# EAGLE design Joe_final hack3 (EAGLE 7.5.0)
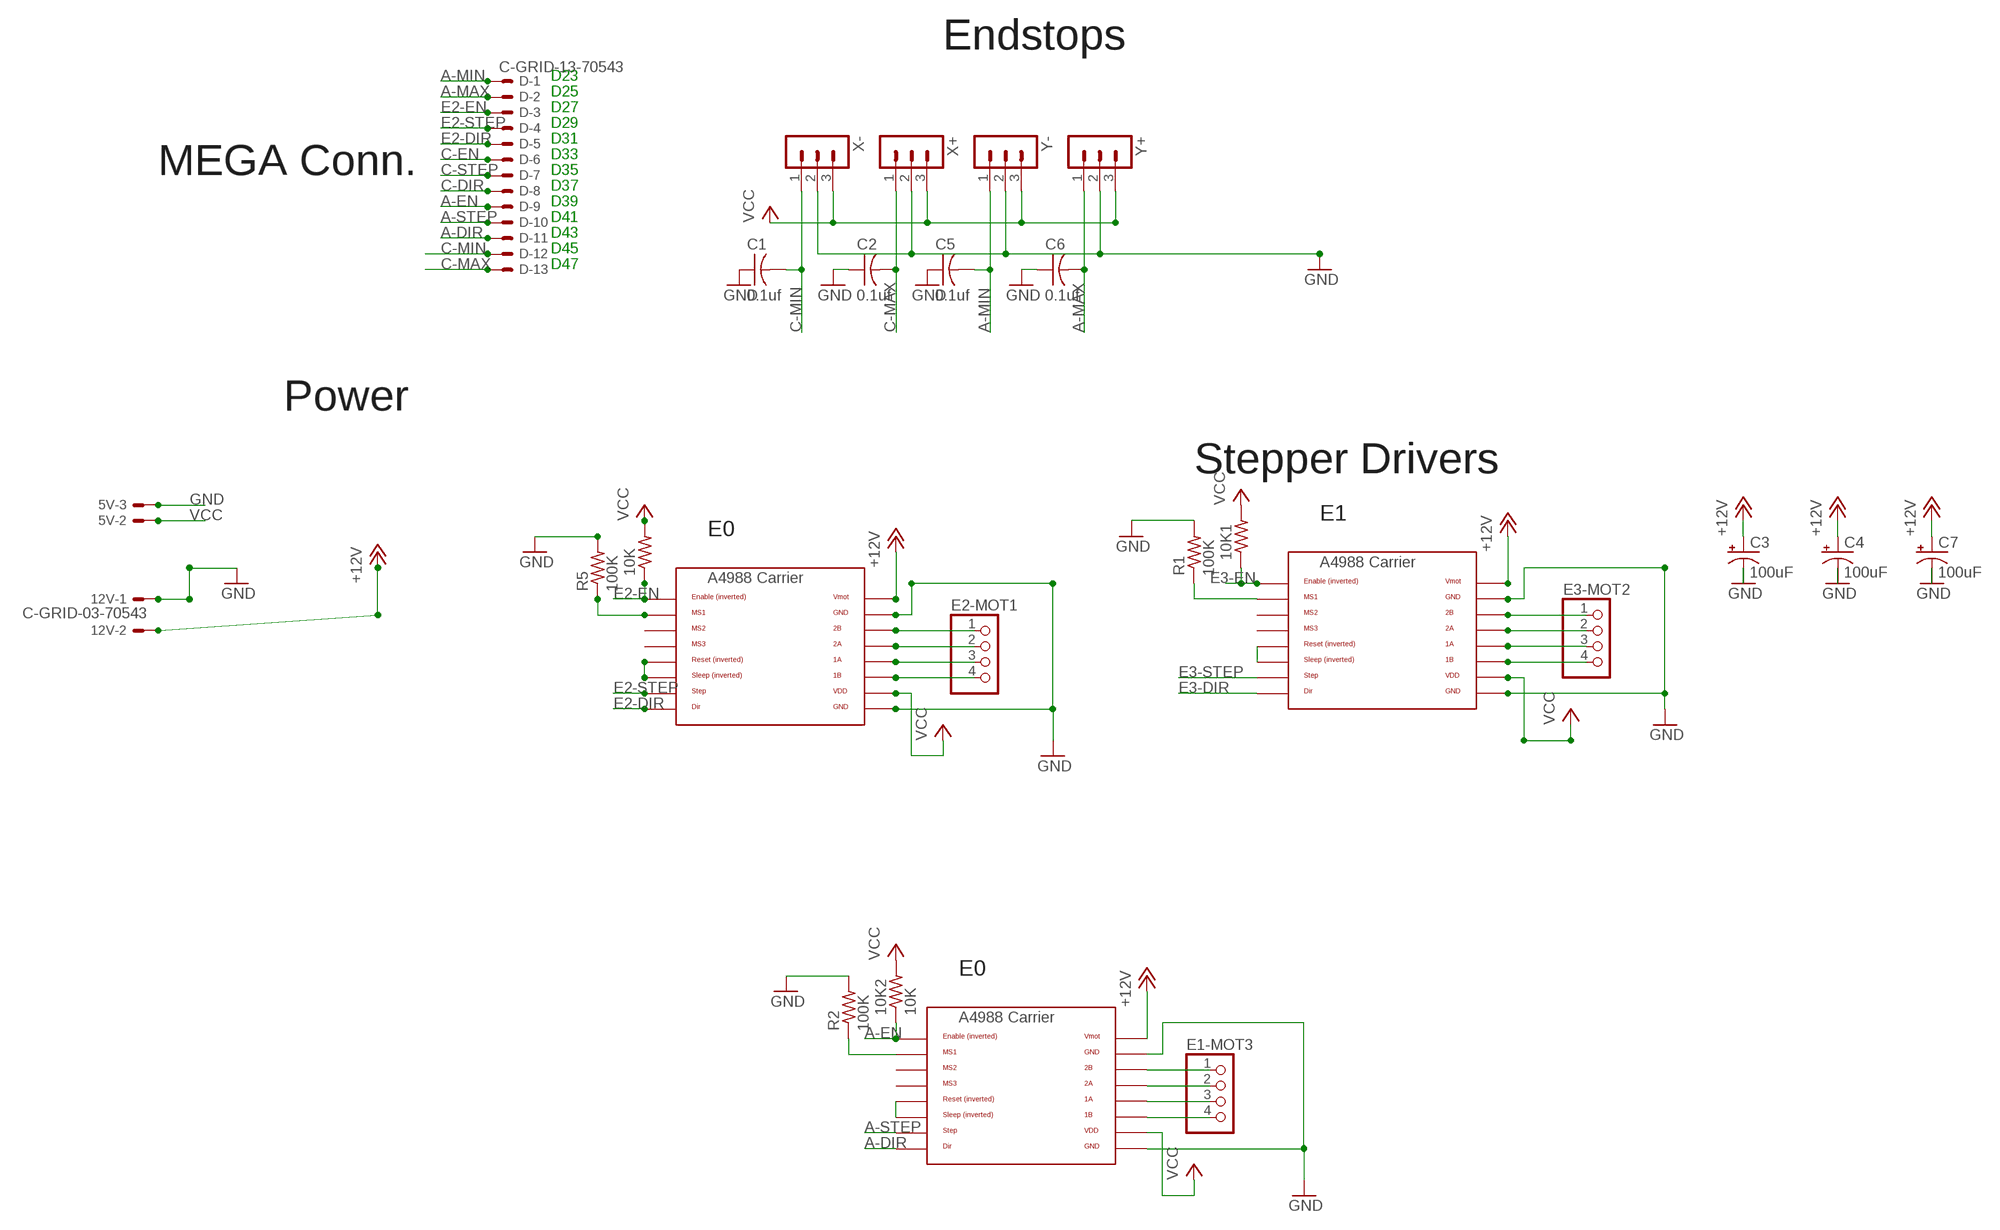
[diagram p0: schematic, sheet 1]

## Parts
5V  C-GRID-03-70543  [70543-03]
10K  RES-US1206FAB  [R1206FAB]
10K1  RES-US1206FAB  [R1206FAB]
10K2  10K  RES-US1206FAB  [R1206FAB]
12V  C-GRID-03-70543  [70543-03]
C1  0.1uf  CAP-US1206FAB  [C1206FAB]
C2  0.1uf  CAP-US1206FAB  [C1206FAB]
C3  100uF  CPOL-US153CLV-0605  [153CLV-0605]
C4  100uF  CPOL-US153CLV-0605  [153CLV-0605]
C5  0.1uf  CAP-US1206FAB  [C1206FAB]
C6  0.1uf  CAP-US1206FAB  [C1206FAB]
C7  100uF  CPOL-US153CLV-0605  [153CLV-0605]
D  C-GRID-13-70543  [70543-13]
E1-MOT3  PINHD-1X4  [1X04]
E2-MOT1  PINHD-1X4  [1X04]
E3-MOT2  PINHD-1X4  [1X04]
R1  100K  RES-US1206FAB  [R1206FAB]
R2  100K  RES-US1206FAB  [R1206FAB]
R5  100K  RES-US1206FAB  [R1206FAB]
U$1  A4988BREAKOUT  [A4988BREAKOUT]
U$4  A4988BREAKOUT  [A4988BREAKOUT]
U$5  A4988BREAKOUT  [A4988BREAKOUT]
X+  3PIN-HEADER  [3PIN-HEADER]
X-  3PIN-HEADER  [3PIN-HEADER]
Y+  3PIN-HEADER  [3PIN-HEADER]
Y-  3PIN-HEADER  [3PIN-HEADER]

## Nets
+12V: 12V.2 C3.+ C4.+ C7.+ U$1.VMOT U$4.VMOT U$5.VMOT
A-DIR: D.11 U$1.DIR
A-EN: 10K2.1 D.9 U$1.EN
A-MAX: C6.2 D.2 Y+.1
A-MIN: C5.2 D.1 Y-.1
A-STEP: D.10 U$1.STEP
C-DIR: D.8
C-EN: D.6
C-MAX: C2.2 D.13 X+.1
C-MIN: C1.2 D.12 X-.1
C-STEP: D.7
E2-DIR: D.5 U$4.DIR
E2-EN: 10K.1 D.3 U$4.EN
E2-STEP: D.4 U$4.STEP
E3-DIR: U$5.DIR
E3-EN: 10K1.1 U$5.EN
E3-STEP: U$5.STEP
GND: 5V.3 12V.1 C1.1 C2.1 C3.- C4.- C5.1 C6.1 C7.- R1.2 R2.2 R5.2 U$1.GND U$1.GND@0(GND) U$4.GND U$4.GND@0(GND) U$5.GND U$5.GND@0(GND) X+.2 X-.2 Y+.2 Y-.2
N$1: E1-MOT3.1 U$1.2B
N$2: U$1.RST U$1.SLP(SLEEP)
N$3: E1-MOT3.2 U$1.2A
N$4: E2-MOT1.1 U$4.2B
N$5: R5.1 U$4.MS1
N$6: E1-MOT3.3 U$1.1A
N$7: R2.1 U$1.MS1
N$8: U$4.RST U$4.SLP(SLEEP)
N$9: E1-MOT3.4 U$1.1B
N$10: E2-MOT1.2 U$4.2A
N$11: E2-MOT1.3 U$4.1A
N$12: E2-MOT1.4 U$4.1B
N$13: E3-MOT2.1 U$5.2B
N$14: E3-MOT2.2 U$5.2A
N$15: E3-MOT2.3 U$5.1A
N$16: E3-MOT2.4 U$5.1B
N$24: U$5.RST U$5.SLP(SLEEP)
N$25: R1.1 U$5.MS1
VCC: 5V.2 10K1.2 10K2.2 10K.2 U$1.VDD U$4.VDD U$5.VDD X+.3 X-.3 Y+.3 Y-.3
Unconnected: 5V.1 12V.3 U$1.MS2 U$1.MS3 U$4.MS2 U$4.MS3 U$5.MS2 U$5.MS3

## Notes on the sheet
- Endstops
- D23
- D25
- D27
- D29
- D31
- D33
- MEGA Conn. | D35
- D37
- D39
- D41
- D43
- D45
- D47
- Power
- Stepper Drivers
- E1
- E0
- E0

## Library data of the parts
5V 12V = con-molex:C-GRID-03: CONNECTOR wire to board 2.54 mm (0.100") pitch header; OC_FARNELL: unknown; OC_NEWARK: unknown
10K 10K1 10K2 R1 R2 R5 = fab:RES-US: Resistor (US Symbol) Variants with postfix FAB are widened to allow the routing of internal traces
C1 C2 C5 C6 = fab:CAP-US
C3 C4 C7 = adafruit:CPOL-US: POLARIZED CAPACITOR, American symbol
D = con-molex:C-GRID-13: CONNECTOR wire to board 2.54 mm (0.100") pitch header; OC_FARNELL: unknown; OC_NEWARK: unknown
E1-MOT3 E2-MOT1 E3-MOT2 = RepRapjr:PINHD-1X4: PIN HEADER
U$1 U$4 U$5 = RepRapjr:A4988BREAKOUT
X+ X- Y+ Y- = ultimachine:3PIN-HEADER: PIN HEADER

## Board
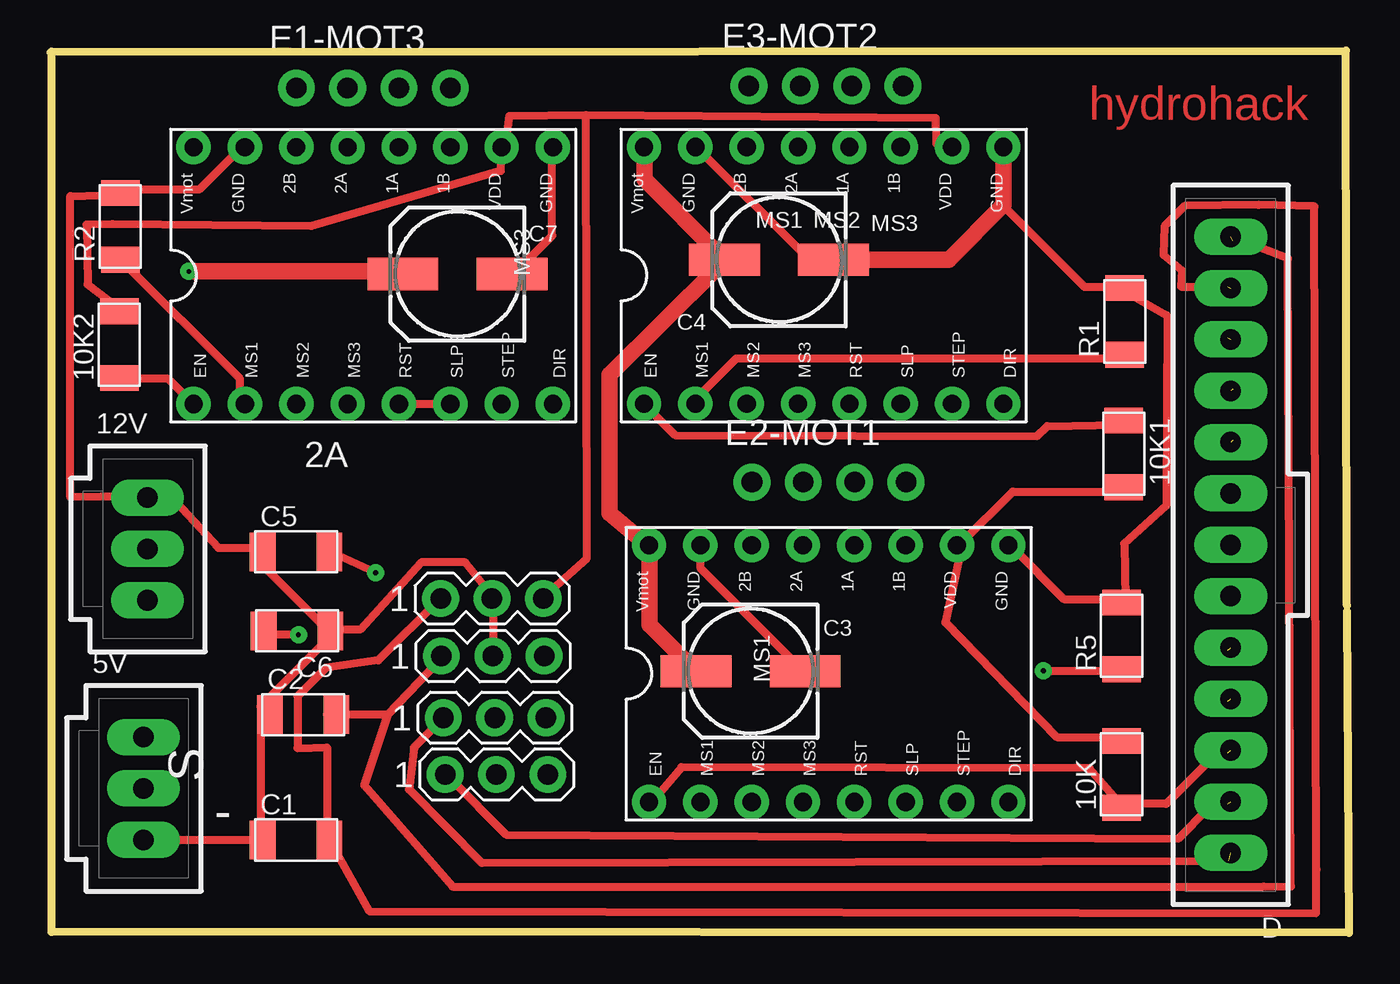
[diagram p1: board, top side]
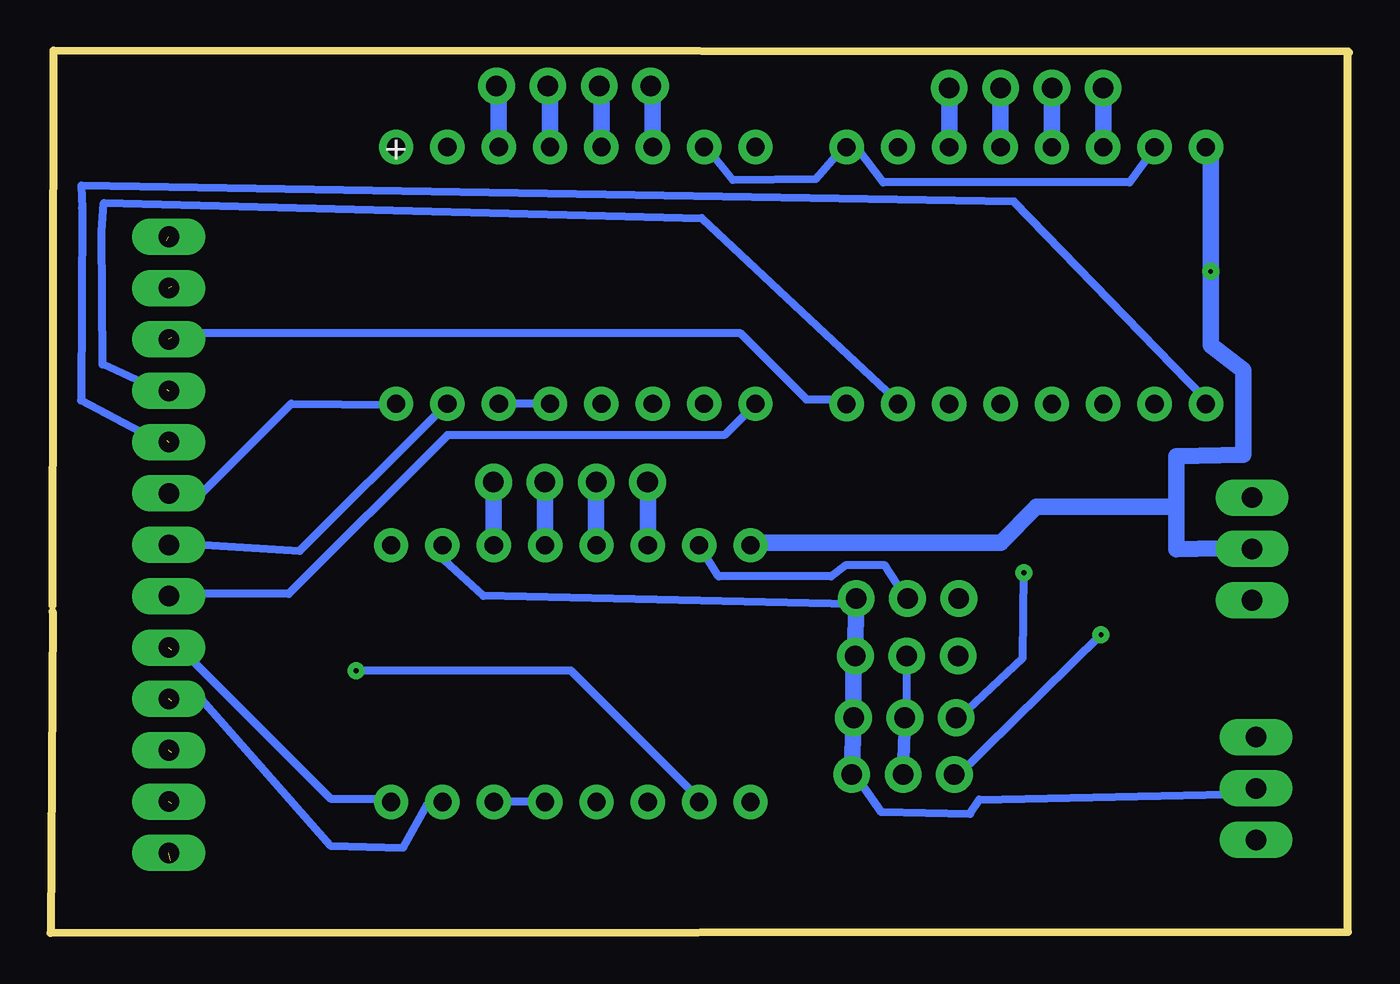
[diagram p2: board, bottom side, seen from below]

Size 64.25 x 43.65 mm. Coordinates in mm from the lower left corner, seen from the top.
Outline: 64.15,16.2 64.1,43.65 0.05,43.6 0.05,43.55
Outline: 64.15,15.9 64.25,0 0.05,0.05 0.05,43.55
Outline: 0.05,43.55 0,43.55
Copper layers (1*16): Top 0.035mm / dielectric 1.6mm / Bottom 0.035mm
Design rules "PCB-CART *": minimum track width 0.1mm, minimum drill 0.1mm, track to track 16mil, track to pad 16mil, pad to pad 16mil, via to via 16mil, smd to smd 16mil, copper to edge 0.1mm, drill to drill 0.1mm, minimum pad ring 0.4mm, minimum via ring 0.3mm, stop-mask expansion 3mil, vias tented up to drill 0.5mm, thermal gap 12mil

### Footprints (pad centres in the part's own frame; a part is rotated, then mirrored left to right if it is on the bottom)
70543-03 = drill 1.016 long: 1 -2.54,0; 2 0,0; 3 2.54,0
R1206FAB = smd 1.27 x 1.905: 1 -1.651,0; 2 1.651,0
C1206FAB = smd 1.27 x 1.905: 1 -1.651,0; 2 1.651,0
153CLV-0605 = smd 3.5 x 1.6: + 2.7,0; - -2.7,0
70543-13 = drill 1.016 long: 1 -15.24,0; 2 -12.7,0; 3 -10.16,0; 4 -7.62,0; 5 -5.08,0; 6 -2.54,0; 7 0,0; 8 2.54,0; 9 5.08,0; 10 7.62,0; 11 10.16,0; 12 12.7,0; 13 15.24,0
1X04 = drill 1.016: 1 -2.54,0; 2 0,0; 3 2.54,0; 4 5.08,0
A4988BREAKOUT = drill 0.9: 1A 8.89,1.27; 1B 11.43,1.27; 2A 6.35,1.27; 2B 3.81,1.27; DIR 16.51,-11.43; EN -1.27,-11.43; GND 16.51,1.27; GND@0 1.27,1.27; MS1 1.27,-11.43; MS2 3.81,-11.43; MS3 6.35,-11.43; RST 8.89,-11.43; SLP 11.43,-11.43; STEP 13.97,-11.43; VDD 13.97,1.27; VMOT -1.27,1.27
3PIN-HEADER = drill 1.016: 1 -2.54,0; 2 0,0; 3 2.54,0

### Placement (x,y rotation side)
5V  4.6,7.15 270 top
10K  53,7.85 90 top
10K1  53.1,23.7 270 top
10K2  3.4,29.1 90 top
12V  4.8,19 270 top
C1  12.15,4.6 0 top
C2  12.5,10.8 0 top
C3  34.64,12.95 180 top
C4  36.05,33.3 180 top
C5  12.15,18.85 0 top
C6  12.2,14.95 180 top
C7  20.14,32.59 180 top
D  58.4,19.2 90 top
E1-MOT3  14.7,41.8 0 top
E2-MOT1  37.25,22.3 0 top
E3-MOT2  37.1,41.9 0 top
R1  53.15,30.25 90 top
R2  3.45,34.95 90 top
R5  53,14.7 90 top
U$1  8.35,37.6 0 top
U$4  30.88,17.91 0 top
U$5  30.64,37.61 0 top
X+  21.88,13.7 0 top
X-  21.84,16.55 0 top
Y+  22.06,7.85 0 top
Y-  21.97,10.65 0 top

### Tracks (layer width: path | path; a pad name or v marks a point on that pad's centre or on a via)
+12V  (via drill 0.24 pad 0.41)
  Top 0.1: 29.38,38.8 U$5.VMOT | 33.18,33.48 C4.+ 33.18,33.23 32.98,32.87 | 29.63,19.05 U$4.VMOT 29.38,19.3 | 31.91,12.97 C3.+ | 17.23,32.72 C7.+
  Top 0.2: 33.25,33.2 C4.+
  Top 0.813: 29.38,38.8 29.38,37.28 33.18,33.48 | 29.63,19.05 29.63,15.25 31.91,12.97 | 32.98,32.87 27.66,27.61 27.66,20.77 29.38,19.3 | v6.85,32.72 17.23,32.72
  Bottom 0.1: 5.33,19.05 4.82,19.05 12V.2 | 6.85,38.8 U$1.VMOT | 29.38,19.3 U$4.VMOT
  Bottom 0.813: 6.85,38.8 v6.85,32.72 6.85,29.06 5.23,27.85 5.23,23.66 8.55,23.59 8.55,21.08 | 8.55,21.08 8.55,18.97 5.33,19.05 | 29.38,19.3 17.23,19.3 15.46,21.08 8.55,21.08
A-DIR  (1 unrouted)
  Bottom 0.406: 58.25,29.43 57.99,29.69 30.14,29.69 26.85,26.39 25.08,26.39 U$1.DIR
A-EN  (1 unrouted)
  Top 0.1: 3.56,27.41 10K2.1
  Top 0.406: 3.56,27.41 5.83,27.41 6.85,26.39 U$1.EN
  Bottom 0.406: 58.5,24.37 59.01,24.37 62.73,26.35 62.69,35.86 62.72,36.97 16.58,36.17 7.1,26.39 U$1.EN
A-MAX  (via drill 0.24 pad 0.41)  (1 unrouted)
  Top 0.1: 19.76,7.66 Y+.1 | 10.64,14.75 C6.2
  Top 0.406: 58.25,6.39 57.32,6.19 55.8,4.67 22.55,4.87 19.76,7.66 | v12.27,14.75 10.64,14.75
  Bottom 0.1: 19.51,7.66 Y+.1
  Bottom 0.406: 19.51,7.66 v12.27,14.75
A-MIN  (via drill 0.24 pad 0.41)  (1 unrouted)
  Top 0.1: 13.94,18.8 C5.2
  Top 0.406: 58.3,3.56 21.33,3.46 17.74,7.1 17.99,9.18 19.25,10.44 Y-.1 | v16.09,17.82 13.94,18.8
  Bottom 0.1: 19.25,10.7 Y-.1
  Bottom 0.406: v16.09,17.82 16.14,13.61 19.25,10.7
A-STEP  (1 unrouted)
  Bottom 0.406: 58.5,26.9 59.01,26.9 61.68,28.12 61.73,34.7 61.62,36.12 32.02,35.37 22.5,26.44 22.55,26.39 U$1.STEP
C-MAX  (1 unrouted)
  Top 0.1: 13.69,10.8 C2.2
  Top 0.406: 16.68,10.8 13.69,10.8 | 16.68,10.8 19.25,13.48 X+.1 | 58.5,34.24 59.01,34.24 61.23,33.37 61.38,2.3 60.02,2.29 19.89,2.29 15.53,7.3 16.68,10.8
C-MIN  (1 unrouted)
  Top 0.1: 13.68,4.62 C1.2 13.94,4.37 | 19.25,16.52 X-.1
  Top 0.406: 13.68,4.62 13.68,9.18 12.22,9.14 12.22,11.72 13.63,13.13 16.22,13.48 19.25,16.52 | 58.25,31.96 55.93,31.98 55.98,32.78 55.07,33.54 55.12,34.95 56.13,35.97 59.77,36.02 62.53,35.95 62.63,3.15 62.62,0.99 15.77,1.09 13.94,4.37
E2-DIR  (1 unrouted)
  Bottom 0.406: 58.25,13.99 57.74,13.99 50.4,6.64 47.61,6.64 U$4.DIR
E2-EN  (1 unrouted)
  Top 0.1: 53.18,6.39 10K.1 52.93,6.39
  Top 0.406: 53.18,6.39 55.21,6.39 57.74,8.92 58.25,8.92 | 52.93,6.39 51.41,8.16 31.21,8.21 29.94,6.69 29.63,6.64 U$4.EN
E2-STEP  (1 unrouted)
  Bottom 0.406: 58.25,11.46 56.79,11.55 50.41,4.33 46.8,4.23 45.59,6.39 45.08,6.39 U$4.STEP
E3-DIR
  Bottom 0.1: 47.36,26.14 U$5.DIR
  Bottom 0.406: 47.36,26.14 52.34,26.19 56.9,21.63
E3-EN
  Top 0.1: 52.93,25.13 10K1.1 | 29.38,26.14 U$5.EN
  Top 0.406: 52.93,25.13 49.32,25.08 48.81,24.57 30.9,24.62 29.38,26.14
  Bottom 0.406: 58.25,16.77 52.46,16.77 44.61,24.62 30.9,24.62 29.38,26.14 U$5.EN
E3-STEP
  Bottom 0.406: 58.25,19.3 51.92,18.9 45.08,25.74 44.83,26.14 U$5.STEP
GND
  Top 0.1: 32.05,38.8 U$5.GND@0 | 21.9,13.85 X+.2 | 21.9,16.45 X-.2 21.79,16.77 | 2.5,21.6 2.54,21.6 2.54,21.58 | 4.8,21.6 12V.1 | 52.93,16.52 R5.2 53.18,16.52 | 52.93,31.96 R1.2 53.18,31.71 | 24.82,38.8 U$1.GND | 23.05,32.72 C7.- | 32.17,19.05 U$4.GND@0 | 37.23,12.97 C3.- | 3.56,36.77 R2.2 3.3,36.52 | 4.82,4.62 5V.3 | 10.64,11.46 C2.1 10.39,11.2 | 13.94,14.75 C6.1 | 10.64,18.04 10.64,18.8 C5.1 10.39,19.05 | 13.68,15 C6.1 | 10.39,4.62 C1.1 | 13.94,15 C6.1
  Top 0.2: 37.45,33.4 38.65,33.4 C4.- | 4.75,21.55 12V.1
  Top 0.406: 32.05,38.8 37.45,33.4 | 21.9,16.45 21.9,13.85 | 2.54,21.6 4.8,21.6 | 52.93,16.52 50.14,16.52 47.61,19.05 U$4.GND | 52.93,31.96 51.16,31.96 47.14,35.99 | 24.82,38.8 24.82,34.5 23.05,32.72 | 53.18,16.52 53.13,19.26 55.2,21.13 55.25,30.54 53.18,31.71 | 32.17,19.05 32.17,18.04 37.23,12.97 | 3.56,36.77 7.35,36.77 9.38,38.8 U$1.GND@0 | 3.3,36.52 0.98,36.45 0.98,21.55 2.54,21.58 | 4.82,4.62 10.39,4.62 10.39,11.2 | 13.94,14.75 10.64,11.46 | 13.68,15 10.64,18.04 | 10.39,19.05 8.31,19.05 5.93,21.63 5.42,21.63 12V.1 | 13.94,15 15.31,15 18.35,18.34 20.52,18.34 21.79,16.77
  Top 0.813: U$5.GND 47.15,36 47.14,35.99 44.45,33.3 C4.-
  Bottom 0.1: 31.7,38.75 31.66,38.8 | 25.08,38.8 U$1.GND 24.82,38.8 | 22.04,16.77 X-.2 | 9.63,38.8 U$1.GND@0
  Bottom 0.2: 21.9,10.85 Y-.2 | 21.9,13.65 X+.2
  Bottom 0.406: 21.9,13.65 21.9,10.85 | 31.7,38.75 30.49,37.23 26.39,37.29 25.08,38.8 | 31.66,38.8 U$5.GND@0 | 22.04,16.77 22.95,18.19 24.92,18.19 25.63,17.63 31.19,17.63 32.11,19.1 32.16,19.2 U$4.GND@0 | 24.82,38.8 24.32,38.8 23.05,37.13 10.85,37.13 9.63,38.8
  Bottom 0.61: Y-.2 Y+.2
N$1
  Bottom 0.813: U$1.2B E1-MOT3.1
N$2
  Top 0.406: U$1.RST 17.4,26.15 19.6,26.15 U$1.SLP
N$3
  Bottom 0.813: U$1.2A E1-MOT3.2
N$4
  Bottom 0.406: 34.69,22.29 E2-MOT1.1
  Bottom 0.813: U$4.2B 34.69,22.29
N$5  (via drill 0.24 pad 0.41)
  Top 0.1: 52.93,12.97 R5.1
  Top 0.406: v49.13,12.97 52.93,12.97
  Bottom 0.1: 32.17,6.64 U$4.MS1
  Bottom 0.406: v49.13,12.97 38.5,12.97 32.17,6.64
N$6
  Bottom 0.813: U$1.1A E1-MOT3.3
N$7
  Top 0.1: 3.56,33.23 R2.1
  Top 0.406: 3.56,33.23 9.38,27.41 9.38,26.39 U$1.MS1
N$8
  Bottom 0.406: U$4.RST U$4.SLP
N$9
  Bottom 0.813: U$1.1B E1-MOT3.4
N$10
  Bottom 0.406: 37.25,19.2 U$4.2A
  Bottom 0.813: E2-MOT1.2 37.25,19.2
N$11
  Bottom 0.406: 39.77,22.29 E2-MOT1.3
  Bottom 0.813: U$4.1A 39.77,22.29
N$12
  Bottom 0.406: 42.31,22.29 E2-MOT1.4
  Bottom 0.813: U$4.1B 42.31,22.29
N$13
  Bottom 0.406: 34.45,41.79 E3-MOT2.1
  Bottom 0.813: U$5.2B 34.45,41.79
N$14
  Bottom 0.406: 36.99,41.79 E3-MOT2.2
  Bottom 0.813: U$5.2A 36.99,41.79
N$15
  Bottom 0.406: 39.53,41.79 E3-MOT2.3
  Bottom 0.813: U$5.1A 39.53,41.79
N$16
  Bottom 0.406: 42.07,41.79 E3-MOT2.4
  Bottom 0.813: U$5.1B 42.07,41.79
N$24
  Bottom 0.406: U$5.RST U$5.SLP
N$25
  Top 0.1: 52.93,28.42 R1.1
  Top 0.406: 52.93,28.42 33.94,28.42 31.91,26.39 U$5.MS1
VCC
  Top 0.1: 3.3,30.95 10K2.2 | 52.93,9.68 10K.2 | 45.08,19.05 U$4.VDD | 52.93,21.84 10K1.2 | 24.57,16.77 X-.3
  Top 0.406: 3.3,30.95 1.84,32.07 1.79,35.04 3.05,35.06 12.9,34.96 22.29,37.7 U$1.VDD 22.55,39.05 22.71,40.42 26.49,40.47 | 26.49,40.47 43.8,40.32 43.81,39.05 44.57,39.05 U$5.VDD | 52.93,9.68 49.81,9.68 44.28,15.36 45.08,19.05 | 52.93,21.84 47.61,21.84 45.08,19.3 U$4.VDD | 26.49,40.47 26.54,18.55 24.57,16.77
  Bottom 0.1: 24.32,7.66 Y+.3 | 44.83,19.05 U$4.VDD | 24.57,16.27 X-.3
  Bottom 0.406: 24.32,7.66 23.15,5.99 18.75,5.89 18.29,6.6 4.82,6.9 5V.2 | 44.83,19.05 45.02,18.65 42.84,16.67 24.57,16.27
  Bottom 0.813: Y+.3 Y-.3 24.52,13.61 X+.3 X-.3

### Text on the board
Top: hydrohack
tNames: MS1 | MS2 | MS3 | MS3 | 2A | MS1 | S | -
bNames: +
Holes: /x3 stepper expander
Document: RAMPS 1.4.2.1 (RepRap Arduino MEGA Pololu Shield) | reprap.org/wiki/RAMPS1.4 | Reversing input power, and inserting stepper drivers incorrectly will destroy electronics.
_tsilk: + | I2C | END STOPS | 21 | 1 | 20 | 1 | - | + | 1 | + | 1 | 1 | 1 | 1 | 1 | 1 | 1 | -